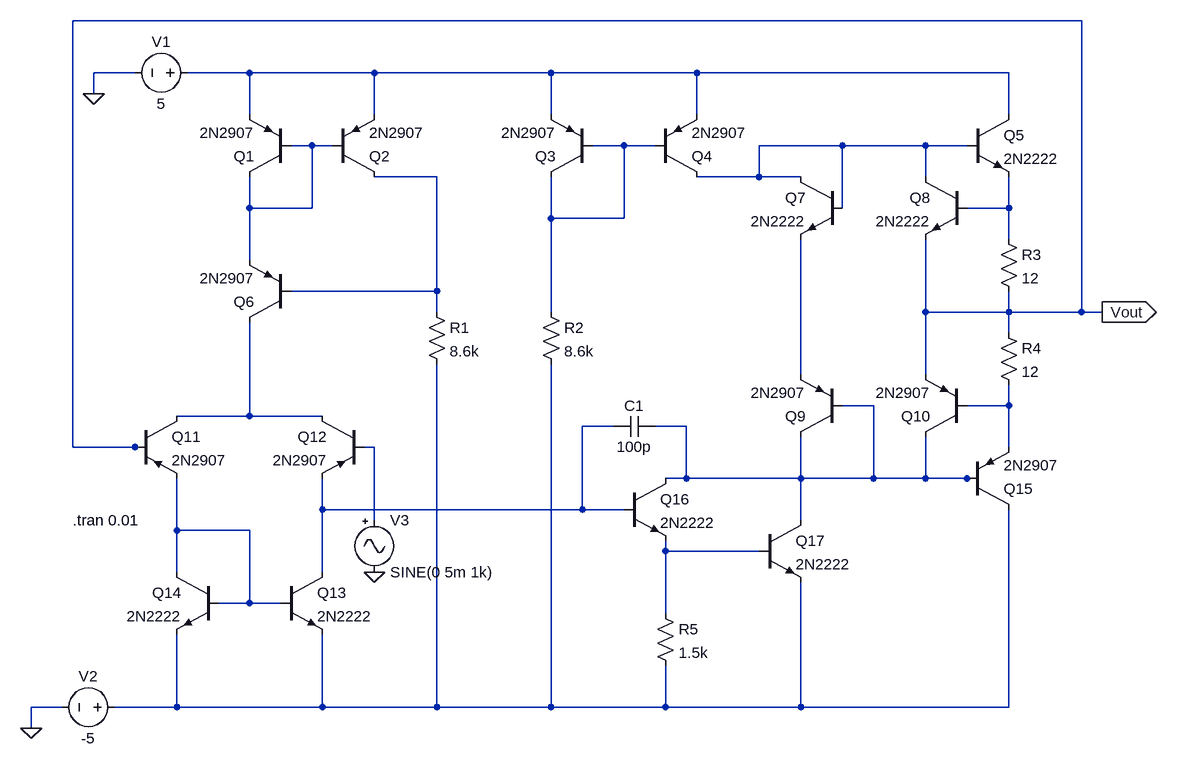
[diagram p0: schematic complete.asc]
complete.asc, the LTspice schematic file:
Version 4
SHEET 1 1684 1096
WIRE 1552 -16 0 -16
WIRE 96 64 32 64
WIRE 272 64 176 64
WIRE 464 64 272 64
WIRE 736 64 464 64
WIRE 960 64 736 64
WIRE 1440 64 960 64
WIRE 32 96 32 64
WIRE 272 128 272 64
WIRE 464 128 464 64
WIRE 736 128 736 64
WIRE 960 128 960 64
WIRE 1440 128 1440 64
WIRE 368 176 336 176
WIRE 400 176 368 176
WIRE 848 176 800 176
WIRE 896 176 848 176
WIRE 1184 176 1056 176
WIRE 1312 176 1184 176
WIRE 1376 176 1312 176
WIRE 560 224 464 224
WIRE 1056 224 1056 176
WIRE 1056 224 960 224
WIRE 1120 224 1056 224
WIRE 1312 224 1312 176
WIRE 272 272 272 224
WIRE 368 272 368 176
WIRE 368 272 272 272
WIRE 1184 272 1184 176
WIRE 1440 272 1440 224
WIRE 1440 272 1376 272
WIRE 736 288 736 224
WIRE 848 288 848 176
WIRE 848 288 736 288
WIRE 1440 320 1440 272
WIRE 272 352 272 272
WIRE 560 400 560 224
WIRE 560 400 336 400
WIRE 560 432 560 400
WIRE 736 432 736 288
WIRE 1312 432 1312 320
WIRE 1440 432 1440 400
WIRE 1440 432 1312 432
WIRE 1552 432 1552 -16
WIRE 1552 432 1440 432
WIRE 1584 432 1552 432
WIRE 1440 464 1440 432
WIRE 1120 528 1120 320
WIRE 1312 528 1312 432
WIRE 1232 576 1184 576
WIRE 1440 576 1440 544
WIRE 1440 576 1376 576
WIRE 272 592 272 448
WIRE 272 592 160 592
WIRE 384 592 272 592
WIRE 832 608 784 608
WIRE 944 608 896 608
WIRE 0 640 0 -16
WIRE 96 640 0 640
WIRE 112 640 96 640
WIRE 464 640 448 640
WIRE 1440 640 1440 576
WIRE 944 688 944 608
WIRE 944 688 912 688
WIRE 1120 688 1120 624
WIRE 1120 688 944 688
WIRE 1232 688 1232 576
WIRE 1232 688 1120 688
WIRE 1312 688 1312 624
WIRE 1312 688 1232 688
WIRE 1376 688 1312 688
WIRE 1392 688 1376 688
WIRE 384 736 384 688
WIRE 784 736 784 608
WIRE 784 736 384 736
WIRE 848 736 784 736
WIRE 464 752 464 640
WIRE 1120 752 1120 688
WIRE 160 768 160 688
WIRE 272 768 160 768
WIRE 912 800 912 784
WIRE 1056 800 912 800
WIRE 160 832 160 768
WIRE 384 832 384 736
WIRE 272 880 272 768
WIRE 272 880 224 880
WIRE 320 880 272 880
WIRE 912 896 912 800
WIRE -16 1040 -64 1040
WIRE 160 1040 160 928
WIRE 160 1040 64 1040
WIRE 384 1040 384 928
WIRE 384 1040 160 1040
WIRE 560 1040 560 512
WIRE 560 1040 384 1040
WIRE 736 1040 736 512
WIRE 736 1040 560 1040
WIRE 912 1040 912 976
WIRE 912 1040 736 1040
WIRE 1120 1040 1120 848
WIRE 1120 1040 912 1040
WIRE 1440 1040 1440 736
WIRE 1440 1040 1120 1040
WIRE -64 1072 -64 1040
FLAG 32 96 0
FLAG -64 1072 0
FLAG 464 832 0
FLAG 1584 432 Vout
IOPIN 1584 432 Out
SYMBOL voltage 192 64 R90
WINDOW 0 -32 56 VBottom 2
WINDOW 3 32 56 VTop 2
SYMATTR InstName V1
SYMATTR Value 5
SYMBOL pnp 336 224 R180
SYMATTR InstName Q1
SYMATTR Value 2N2907
SYMBOL pnp 400 224 M180
SYMATTR InstName Q2
SYMATTR Value 2N2907
SYMBOL pnp 800 224 R180
SYMATTR InstName Q3
SYMATTR Value 2N2907
SYMBOL pnp 896 224 M180
SYMATTR InstName Q4
SYMATTR Value 2N2907
SYMBOL npn 1376 128 R0
SYMATTR InstName Q5
SYMATTR Value 2N2222
SYMBOL pnp 336 448 R180
SYMATTR InstName Q6
SYMATTR Value 2N2907
SYMBOL npn 1184 224 M0
SYMATTR InstName Q7
SYMATTR Value 2N2222
SYMBOL npn 1376 224 M0
SYMATTR InstName Q8
SYMATTR Value 2N2222
SYMBOL res 544 416 R0
SYMATTR InstName R1
SYMATTR Value 8.6k
SYMBOL res 720 416 R0
SYMATTR InstName R2
SYMATTR Value 8.6k
SYMBOL res 1424 304 R0
SYMATTR InstName R3
SYMATTR Value 12
SYMBOL res 1424 448 R0
SYMATTR InstName R4
SYMATTR Value 12
SYMBOL pnp 1184 624 R180
SYMATTR InstName Q9
SYMATTR Value 2N2907
SYMBOL pnp 1376 624 R180
SYMATTR InstName Q10
SYMATTR Value 2N2907
SYMBOL pnp 96 592 R0
SYMATTR InstName Q11
SYMATTR Value 2N2907
SYMBOL pnp 448 592 M0
SYMATTR InstName Q12
SYMATTR Value 2N2907
SYMBOL npn 320 832 R0
SYMATTR InstName Q13
SYMATTR Value 2N2222
SYMBOL npn 224 832 M0
SYMATTR InstName Q14
SYMATTR Value 2N2222
SYMBOL pnp 1376 736 M180
SYMATTR InstName Q15
SYMATTR Value 2N2907
SYMBOL npn 848 688 R0
SYMATTR InstName Q16
SYMATTR Value 2N2222
SYMBOL npn 1056 752 R0
SYMATTR InstName Q17
SYMATTR Value 2N2222
SYMBOL res 896 880 R0
SYMATTR InstName R5
SYMATTR Value 1.5k
SYMBOL cap 896 592 R90
WINDOW 0 0 32 VBottom 2
WINDOW 3 32 32 VTop 2
SYMATTR InstName C1
SYMATTR Value 100p
SYMBOL voltage 80 1040 R90
WINDOW 0 -32 56 VBottom 2
WINDOW 3 32 56 VTop 2
SYMATTR InstName V2
SYMATTR Value -5
SYMBOL Misc/signal 464 736 R0
SYMATTR InstName V3
SYMATTR Value SINE(0 5m 1k)
TEXT 0 752 Left 2 !.tran 0.01

The netlist it stands for:
* complete.asc
V1 N001 0 5
Q1 N002 N002 N001 0 2N2907
Q2 N005 N002 N001 0 2N2907
Q3 N003 N003 N001 0 2N2907
Q4 N004 N003 N001 0 2N2907
Q5 N001 N004 N006 0 2N2222
Q6 N010 N005 N002 0 2N2907
Q7 N004 N004 N007 0 2N2222
Q8 N004 N006 Vout 0 2N2222
R1 N005 N015 8.6k
R2 N003 N015 8.6k
R3 N006 Vout 12
R4 Vout N009 12
Q9 N008 N008 N007 0 2N2907
Q10 N008 N009 Vout 0 2N2907
Q11 N010 Vout N013 0 2N2907
Q12 N010 N012 N011 0 2N2907
Q13 N011 N013 N015 0 2N2222
Q14 N013 N013 N015 0 2N2222
Q15 N015 N008 N009 0 2N2907
Q16 N008 N011 N014 0 2N2222
Q17 N008 N014 N015 0 2N2222
R5 N014 N015 1.5k
C1 N008 N011 100p
V2 N015 0 -5
V3 N012 0 SINE(0 5m 1k)
.model NPN NPN
.model PNP PNP
.lib standard.bjt
.tran 0.01
.backanno
.end